# EAGLE design PDB (EAGLE 9.6.0)
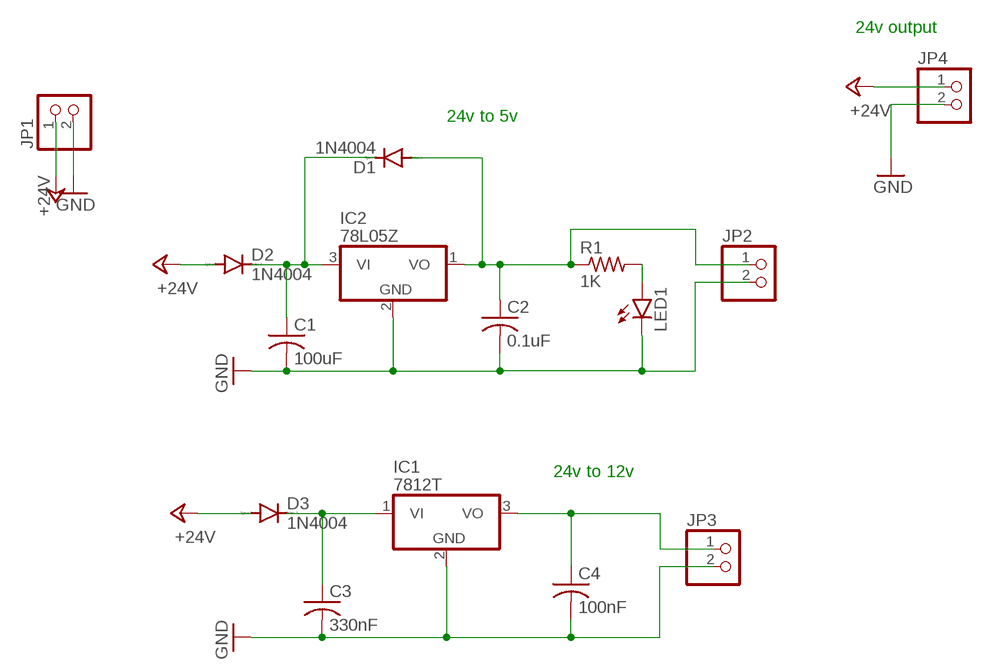
[diagram p0: schematic, sheet 1]

## Parts
C1  100uF  C-US025-024X044  [C025-024X044]
C2  0.1uF  C-US025-024X044  [C025-024X044]
C3  330nF  C-US025-024X044  [C025-024X044]
C4  100nF  C-US025-024X044  [C025-024X044]
D1  1N4004  [DO41-10]
D2  1N4004  [DO41-10]
D3  1N4004  [DO41-10]
IC1  7812T  [TO220H]
IC2  78L05Z  [TO92]
JP1  PINHD-1X2  [1X02]
JP2  PINHD-1X2  [1X02]
JP3  PINHD-1X2  [1X02]
JP4  PINHD-1X2  [1X02]
LED1  LED5MM  [LED5MM]
R1  1K  R-US_0204/7  [0204/7]

## Nets
+24V: D2.A D3.A JP1.1 JP4.1
GND: C1.2 C2.2 C3.2 C4.2 IC1.2(GND) IC2.2(GND) JP1.2 JP2.2 JP3.2 JP4.2 LED1.K(C)
N$1: C3.1 D3.C IC1.1(VI)
N$2: C1.1 D1.C D2.C IC2.3(VI)
N$3: C2.1 D1.A IC2.1(VO) JP2.1 R1.1
N$5: C4.1 IC1.3(VO) JP3.1
N$6: LED1.A R1.2

## Notes on the sheet
- 24v output
- 24v to 5v
- 24v to 12v

## Library data of the parts
C1-C4 = rcl:C-US: CAPACITOR, American symbol; SPICEPREFIX: C
D1-D3 = diode:1N4004: DIODE general purpose rectifier, 1 A
IC1 IC2 = adafruit:78*: Positive VOLTAGE REGULATOR Added bigger pads to the TO-92 package
JP1-JP4 = pinhead:PINHD-1X2: PIN HEADER
LED1 = led:LED: LED OSRAM: - CHIPLED LG R971, LG N971, LY N971, LG Q971, LY Q971, LO R971, LY R971 LH N974, LH R974 LS Q976, LO Q976, LY Q976 LO Q996 - Hyper CHIPLED LW Q18S LB Q993, LB Q99A, LB R99A - SideLED LS A670, LO A670, LY A670, LG A670, LP A670 LB A673, LV A673, LT A673, LW A673 LH A674 LY A675 LS A676, LA A676, LO A676, LY A676, LW A676 LS A679, LY A679, LG A679 - Hyper Micro SIDELED® LS Y876, LA Y876, LO Y876, LY Y876 LT Y87S - SmartLED LW L88C, LW L88S LB L89C, LB L89S, LG L890 LS L89K, LO L89K, LY L89K LS L896, LA L896, LO L896, LY L896 - TOPLED LS T670, LO T670, LY T670, LG T670, LP T670 LSG T670, LSP T670, LSY T670, LOP T670, LYG T670 LG T671, LOG T671, LSG T671 LB T673, LV T673, LT T673, LW T673 LH T674 LS T676, LA T676, LO T676, LY T676, LB T676, LH T676, LSB T676, LW T676 LB T67C, LV T67C, LT T67C, LS T67K, LO T67K, LY T67K, LW E67C LS E67B, LA E67B, LO E67B, LY E67B, LB E67C, LV E67C, LT E67C LW T67C LS T679, LY T679, LG T679 LS T770, LO T770, LY T770, LG T770, LP T770 LB T773, LV T773, LT T773, LW T773 LH T774 LS E675, LA E675, LY E675, LS T675 LS T776, LA T776, LO T776, LY T776, LB T776 LHGB T686 LT T68C, LB T68C - Hyper Mini TOPLED® LB M676 - Mini TOPLED Santana® LG M470 LS M47K, LO M47K, LY M47K Source: http://www.osram.convergy.de LUXEON: - LUMILED® LXK2-PW12-R00, LXK2-PW12-S00, LXK2-PW14-U00, LXK2-PW14-V00 LXK2-PM12-R00, LXK2-PM12-S00, LXK2-PM14-U00 LXK2-PE12-Q00, LXK2-PE12-R00, LXK2-PE12-S00, LXK2-PE14-T00, LXK2-PE14-U00 LXK2-PB12-K00, LXK2-PB12-L00, LXK2-PB12-M00, LXK2-PB14-N00, LXK2-PB14-P00, LXK2-PB14-Q00 LXK2-PR12-L00, LXK2-PR12-M00, LXK2-PR14-Q00, LXK2-PR14-R00 LXK2-PD12-Q00, LXK2-PD12-R00, LXK2-PD12-S00 LXK2-PH12-R00, LXK2-PH12-S00 LXK2-PL12-P00, LXK2-PL12-Q00, LXK2-PL12-R00 Source: www.luxeon.com KINGBRIGHT: KA-3528ASYC Source: www.kingbright.com
R1 = rcl:R-US_: RESISTOR, American symbol; SPICEPREFIX: R

## Board
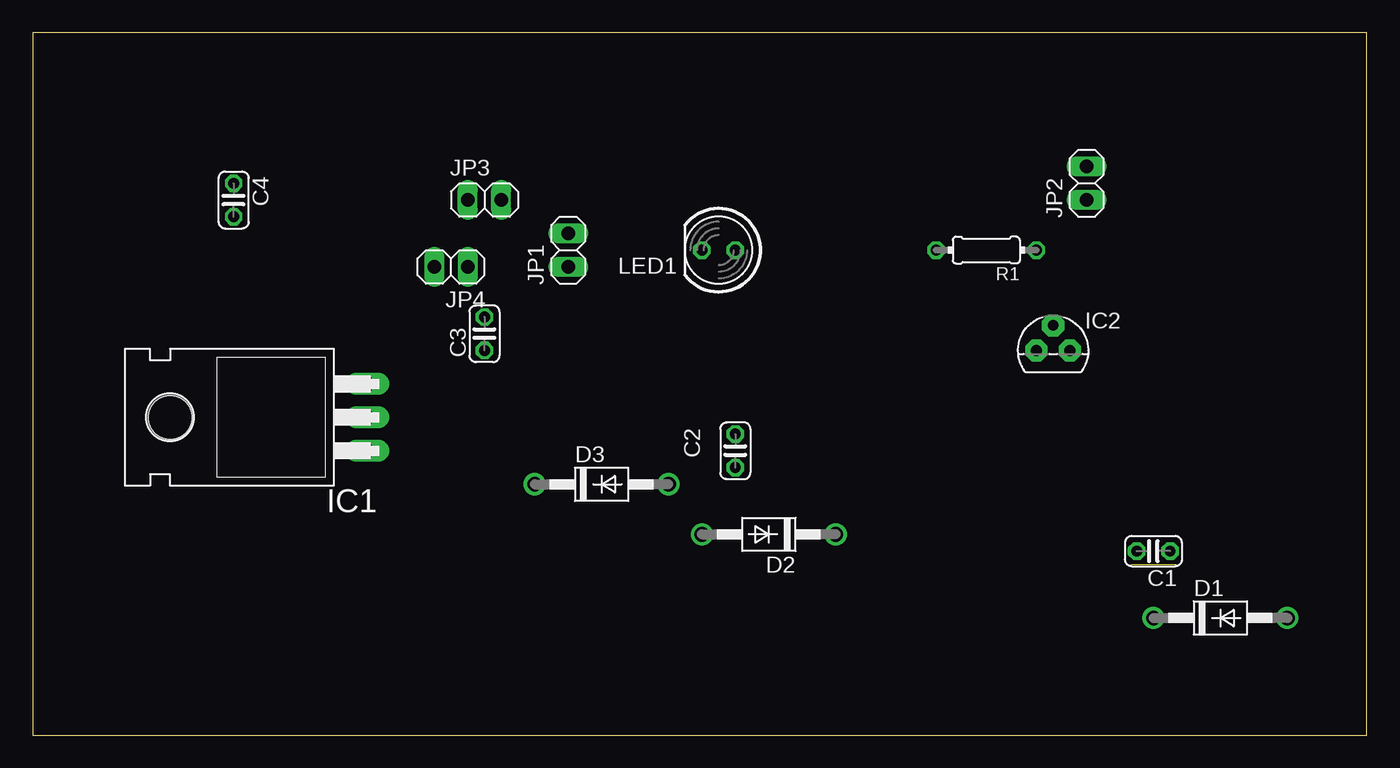
[diagram p1: board, top side]
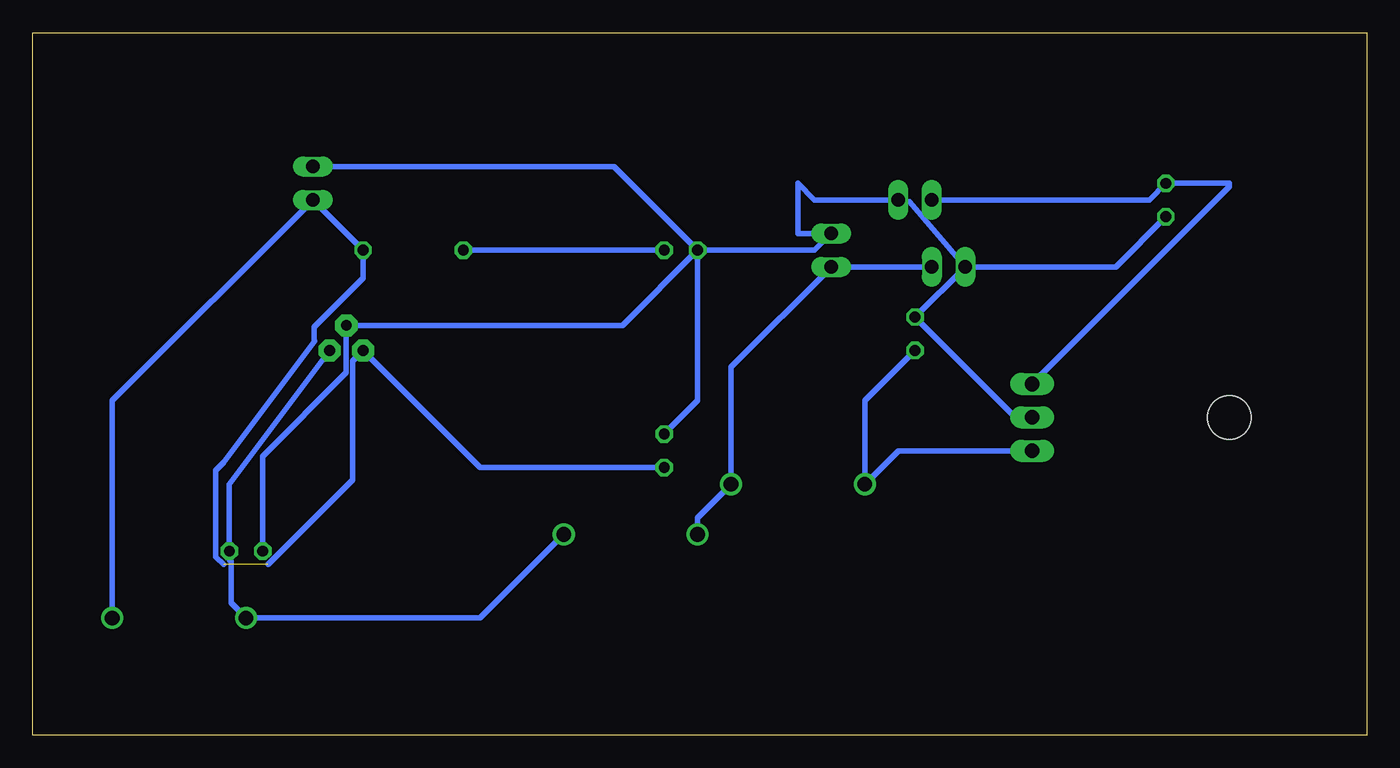
[diagram p2: board, bottom side, seen from below]

Size 101.27 x 53.33 mm. Coordinates in mm from the lower left corner, seen from the top.
Outline: 0,0 101.27,0 101.27,53.33 0,53.33 0,0
Copper layers (1*16): Top 0.035mm / dielectric 1.5mm / Bottom 0.035mm
Design rules "default": minimum track width 6mil, minimum drill 0.35mm, track to track 6mil, track to pad 6mil, pad to pad 6mil, via to via 6mil, smd to smd 6mil, copper to edge 40mil, drill to drill 6mil, minimum pad ring 10mil, minimum via ring 8mil, stop-mask expansion 4mil, vias tented up to drill 0mil, thermal gap 10mil

### Footprints (pad centres in the part's own frame; a part is rotated, then mirrored left to right if it is on the bottom)
C025-024X044 = drill 0.813 octagon: 1 -1.27,0; 2 1.27,0
DO41-10 = drill 1.118: A 5.08,0; C -5.08,0
TO220H = drill 1.118 long: 1 -2.54,-10.16; 2 0,-10.16; 3 2.54,-10.16 | hole 3.302: 0,4.826
TO92 = drill 0.813 pad 1.676 octagon: 1 -1.27,0; 2 0,1.905; 3 1.27,0
1X02 = drill 1.016 long: 1 -1.27,0; 2 1.27,0
LED5MM = drill 0.813 octagon: A -1.27,0; K 1.27,0
0204/7 = drill 0.813 octagon: 1 -3.81,0; 2 3.81,0

### Placement (x,y rotation side)
C1  85.09,13.97 180 top
C2  53.34,21.59 90 top
C3  34.29,30.48 90 top
C4  15.24,40.64 270 top
D1  90.17,8.89 0 top
D2  55.88,15.24 180 top
D3  43.18,19.05 0 top
IC1  15.24,24.13 90 top
IC2  77.47,29.21 0 top
JP1  40.64,36.83 90 top
JP2  80.01,41.91 90 top
JP3  34.29,40.64 0 top
JP4  31.75,35.56 180 top
LED1  52.07,36.83 180 top
R1  72.39,36.83 180 top

### Tracks (layer width: path | path; a pad name or v marks a point on that pad's centre or on a via)
+24V
  Bottom 0.406: D2.A 50.8,16.51 D3.A 48.26,27.94 JP1.1 JP4.1
GND
  Bottom 0.406: JP4.2 34.72,40.51 JP3.2 41.91,40.64 43.18,41.91 43.18,38.1 JP1.2 41.91,36.83 LED1.K | LED1.K 57.15,43.18 JP2.2 | C1.2 83.82,21.17 77.47,27.52 IC2.2 56.51,31.12 LED1.K | JP4.2 C3.2 26.67,24.13 IC1.2 | JP4.2 19.05,35.56 C4.2 | LED1.K 50.8,25.4 C2.2
N$1
  Bottom 0.406: C3.1 38.1,25.4 D3.C 35.56,21.59 IC1.1
N$2
  Bottom 0.406: IC2.3 86.36,19.05 C1.1 86.36,13.32 86.22,13.19 86.22,10.02 D1.C 67.31,8.89 D2.C
N$3  (1 unrouted)
  Bottom 0.406: 86.78,12.95 87.38,13.55 87.38,20.09 86.78,20.69 79.86,29.91 79.93,29.99 79.93,30.97 76.2,34.71 R1.1 JP2.1 95.25,25.4 D1.A | 83.4,12.95 76.99,19.37 76.99,28.42 IC2.1 67.31,20.32 C2.1
N$5
  Bottom 0.406: IC1.3 10.41,41.66 10.41,41.91 C4.1 16.51,40.64 JP3.1
N$6
  Bottom 0.406: R1.2 LED1.A